# EAGLE design sphericon_v3 (EAGLE 9.6.2)

## Sheet 1 of 2
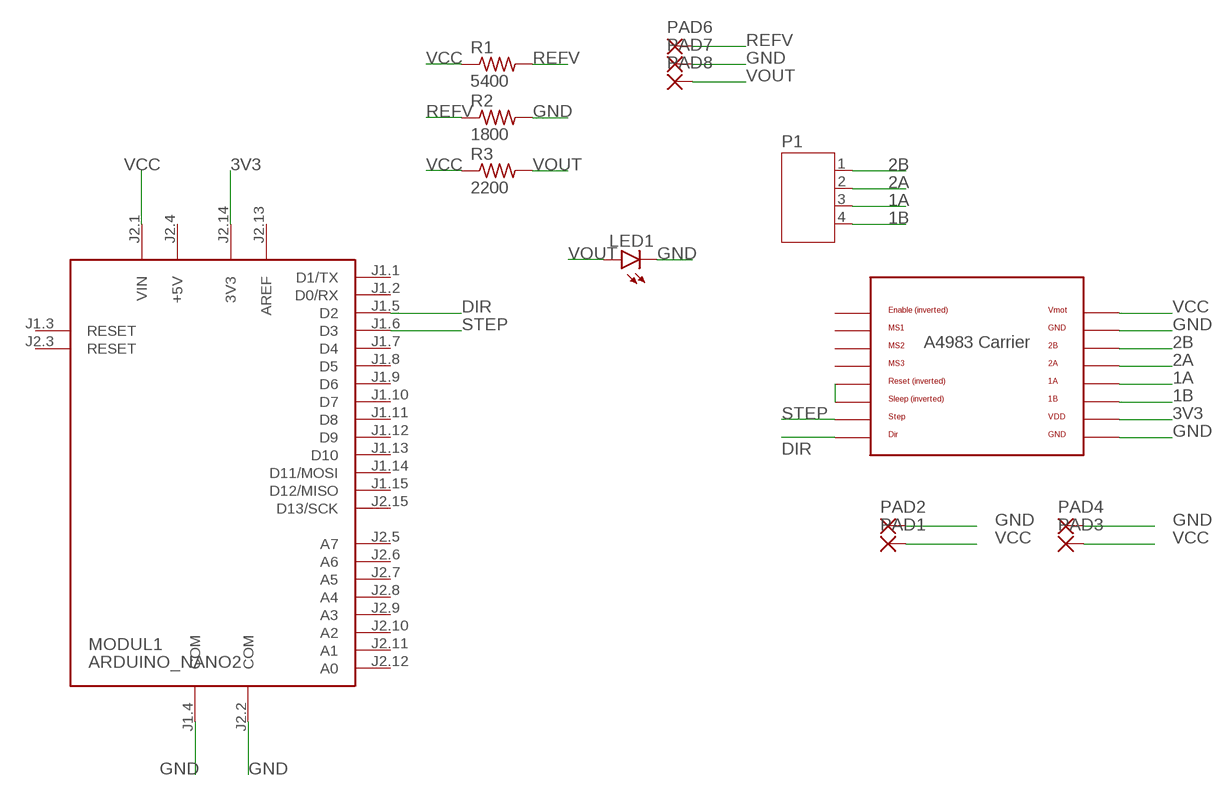
[diagram p0: schematic, sheet 1]

### Parts
LED1  LED3MM  [LED3MM]
MODUL1  ARDUINO_NANO2  [ARDUINO_NANO2]
P1  JST-PH4  [JST-PH4]
PAD1  1,6/0,8  [1,6/0,8]
PAD2  1,6/0,8  [1,6/0,8]
PAD3  1,6/0,8  [1,6/0,8]
PAD4  1,6/0,8  [1,6/0,8]
PAD6  1,6/0,8  [1,6/0,8]
PAD7  1,6/0,8  [1,6/0,8]
PAD8  1,6/0,8  [1,6/0,8]
R1  5400  R-US_0204/2V  [0204V]
R2  1800  R-US_0204/2V  [0204V]
R3  2200  R-US_0204/2V  [0204V]
U$6  POLOLU_A4983CARRIER  [A4983CARRIER]

### Nets
1A: P1.3 U$6.1A
1B: P1.4 U$6.1B
2A: P1.2 U$6.2A
2B: P1.1 U$6.2B
3V3: MODUL1.J2.14(3V3) U$6.VDD
DIR: MODUL1.J1.5(D2) U$6.DIR
GND: LED1.K(C) MODUL1.J1.4(COM) MODUL1.J2.2(COM) PAD2.1(P) PAD4.1(P) PAD7.1(P) R2.2 U$6.GND U$6.GND@0(GND)
N$5 [WiderTraces]: U$6.RST U$6.SLP(SLEEP)
REFV: PAD6.1(P) R1.2 R2.1
STEP: MODUL1.J1.6(D3) U$6.STEP
VCC: MODUL1.J2.1(VIN) PAD1.1(P) PAD3.1(P) R1.1 R3.1 U$6.VMOT
VOUT: LED1.A PAD8.1(P) R3.2
Unconnected: MODUL1.J1.1(D1/TX) MODUL1.J1.2(D0/RX) MODUL1.J1.3(RESET) MODUL1.J1.7(D4) MODUL1.J1.8(D5) MODUL1.J1.9(D6) MODUL1.J1.10(D7) MODUL1.J1.11(D8) MODUL1.J1.12(D9) MODUL1.J1.13(D10) MODUL1.J1.14(D11/MOSI) MODUL1.J1.15(D12/MISO) MODUL1.J2.3(RESET) MODUL1.J2.5(A7) MODUL1.J2.6(A6) MODUL1.J2.7(A5) MODUL1.J2.8(A4) MODUL1.J2.9(A3) MODUL1.J2.10(A2) MODUL1.J2.11(A1) MODUL1.J2.12(A0) MODUL1.J2.15(D13/SCK) U$6.EN U$6.MS1 U$6.MS2 U$6.MS3

## Sheet 2 of 2

## Power pins joined to a net without a drawn wire
+5V: MODUL1.J2.4(+5V)
AREF: MODUL1.J2.13(AREF)

## Library data of the parts
LED1 = led:LED: LED OSRAM: - CHIPLED LG R971, LG N971, LY N971, LG Q971, LY Q971, LO R971, LY R971 LH N974, LH R974 LS Q976, LO Q976, LY Q976 LO Q996 - Hyper CHIPLED LW Q18S LB Q993, LB Q99A, LB R99A - SideLED LS A670, LO A670, LY A670, LG A670, LP A670 LB A673, LV A673, LT A673, LW A673 LH A674 LY A675 LS A676, LA A676, LO A676, LY A676, LW A676 LS A679, LY A679, LG A679 - Hyper Micro SIDELED® LS Y876, LA Y876, LO Y876, LY Y876 LT Y87S - SmartLED LW L88C, LW L88S LB L89C, LB L89S, LG L890 LS L89K, LO L89K, LY L89K LS L896, LA L896, LO L896, LY L896 - TOPLED LS T670, LO T670, LY T670, LG T670, LP T670 LSG T670, LSP T670, LSY T670, LOP T670, LYG T670 LG T671, LOG T671, LSG T671 LB T673, LV T673, LT T673, LW T673 LH T674 LS T676, LA T676, LO T676, LY T676, LB T676, LH T676, LSB T676, LW T676 LB T67C, LV T67C, LT T67C, LS T67K, LO T67K, LY T67K, LW E67C LS E67B, LA E67B, LO E67B, LY E67B, LB E67C, LV E67C, LT E67C LW T67C LS T679, LY T679, LG T679 LS T770, LO T770, LY T770, LG T770, LP T770 LB T773, LV T773, LT T773, LW T773 LH T774 LS E675, LA E675, LY E675, LS T675 LS T776, LA T776, LO T776, LY T776, LB T776 LHGB T686 LT T68C, LB T68C - Hyper Mini TOPLED® LB M676 - Mini TOPLED Santana® LG M470 LS M47K, LO M47K, LY M47K Source: http://www.osram.convergy.de LUXEON: - LUMILED® LXK2-PW12-R00, LXK2-PW12-S00, LXK2-PW14-U00, LXK2-PW14-V00 LXK2-PM12-R00, LXK2-PM12-S00, LXK2-PM14-U00 LXK2-PE12-Q00, LXK2-PE12-R00, LXK2-PE12-S00, LXK2-PE14-T00, LXK2-PE14-U00 LXK2-PB12-K00, LXK2-PB12-L00, LXK2-PB12-M00, LXK2-PB14-N00, LXK2-PB14-P00, LXK2-PB14-Q00 LXK2-PR12-L00, LXK2-PR12-M00, LXK2-PR14-Q00, LXK2-PR14-R00 LXK2-PD12-Q00, LXK2-PD12-R00, LXK2-PD12-S00 LXK2-PH12-R00, LXK2-PH12-S00 LXK2-PL12-P00, LXK2-PL12-Q00, LXK2-PL12-R00 Source: www.luxeon.com KINGBRIGHT: KA-3528ASYC Source: www.kingbright.com
MODUL1 = arduino:ARDUINO_NANO2: Arduino Nano2 Auto generated by modulcreator.ulp \;; ANZAHL: 2; MODUL: TRUE; STECKX0: -76200; STECKX1: 76200; STECKY0: 177800; STECKY1: 177800
P1 = jst-ph:JST-PH4
PAD1-PAD4 PAD6-PAD8 = wirepad:1,6/0,8: THROUGH-HOLE PAD
R1-R3 = resistor:R-US_: RESISTOR, American symbol
U$6 = RepRapjr:POLOLU_A4983CARRIER

## Net classes
1 WiderTraces: width 1.27 mm

## Board
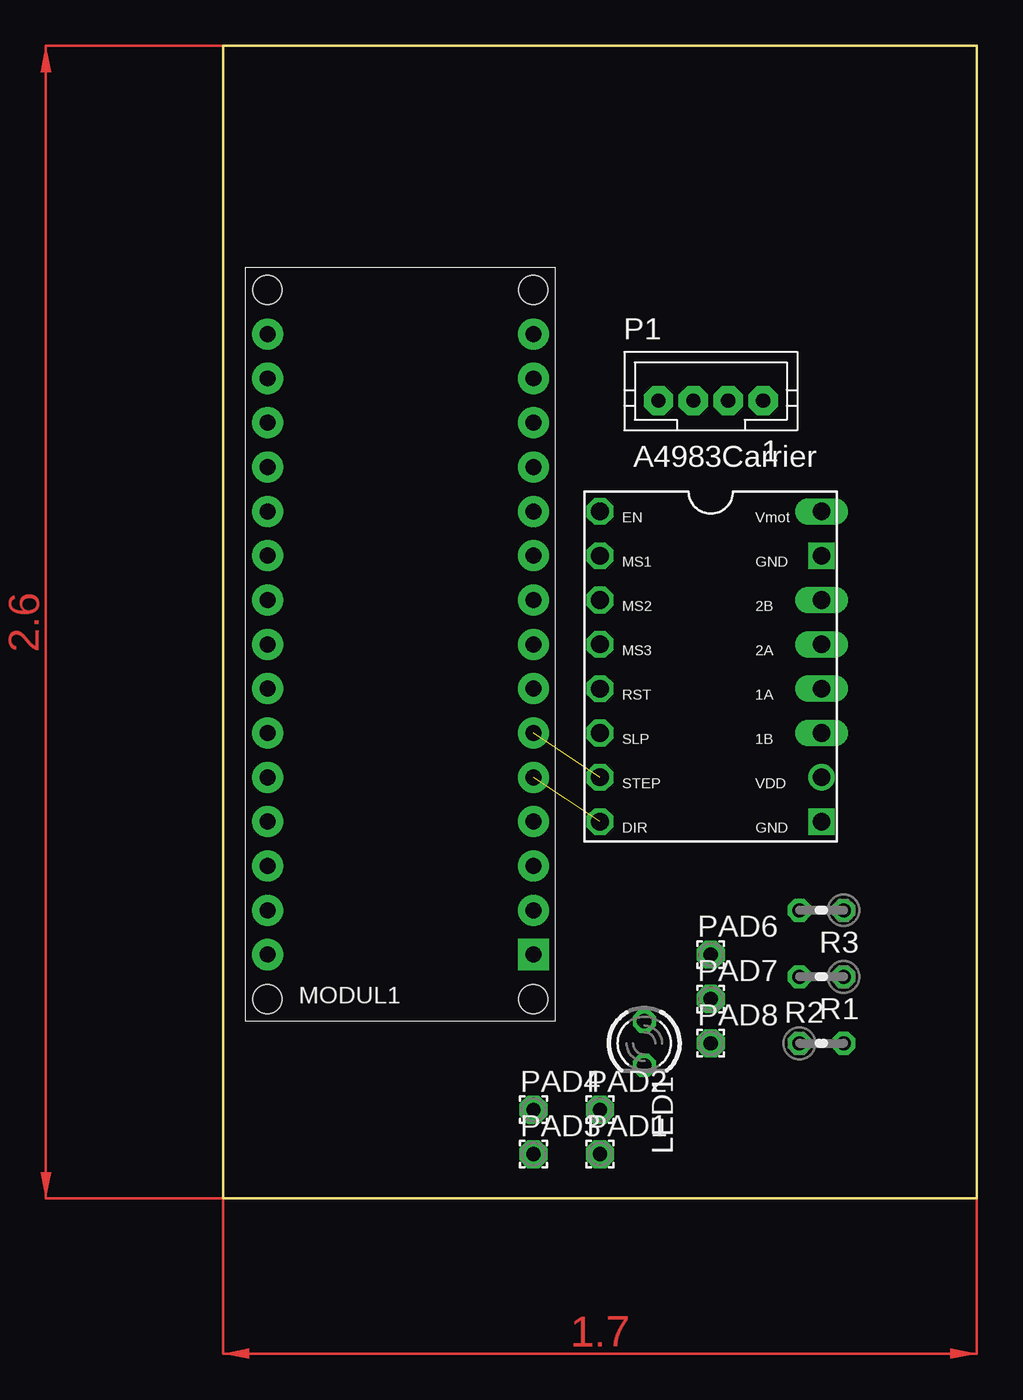
[diagram p1: board, top side]
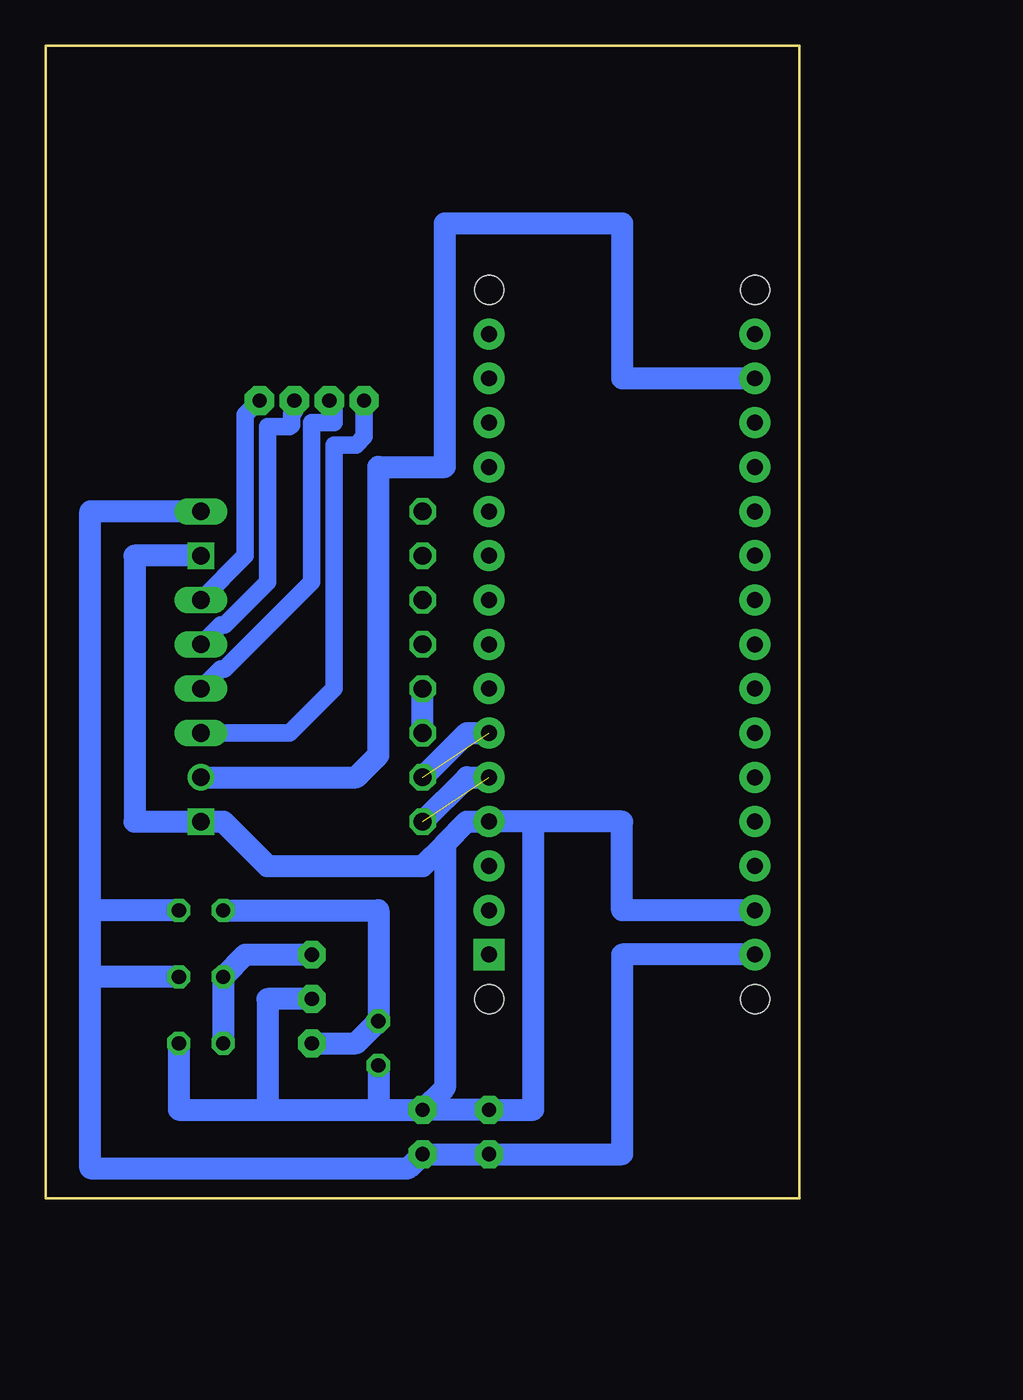
[diagram p2: board, bottom side, seen from below]

Size 43.18 x 66.04 mm. Coordinates in mm from the lower left corner, seen from the top.
Outline: 0,0 0,66.04 43.18,66.04 43.18,0 0,0
Copper layers (1*16): Top 0.035mm / dielectric 1.5mm / Bottom 0.035mm
Design rules "default": minimum track width 6mil, minimum drill 0.35mm, track to track 6mil, track to pad 6mil, pad to pad 6mil, via to via 6mil, smd to smd 6mil, copper to edge 40mil, drill to drill 6mil, minimum pad ring 10mil, minimum via ring 8mil, stop-mask expansion 4mil, vias tented up to drill 0mil, thermal gap 10mil

### Footprints (pad centres in the part's own frame; a part is rotated, then mirrored left to right if it is on the bottom)
LED3MM = drill 0.813 octagon: A -1.27,0; K 1.27,0
ARDUINO_NANO2 = drill 0.914 pad 1.778 square: J1.1 -7.62,17.78 | drill 0.914 pad 1.778: J1.2 -7.62,15.24; J1.3 -7.62,12.7; J1.4 -7.62,10.16; J1.5 -7.62,7.62; J1.6 -7.62,5.08; J1.7 -7.62,2.54; J1.8 -7.62,0; J1.9 -7.62,-2.54; J1.10 -7.62,-5.08; J1.11 -7.62,-7.62; J1.12 -7.62,-10.16; J1.13 -7.62,-12.7; J1.14 -7.62,-15.24; J1.15 -7.62,-17.78; J2.1 7.62,17.78; J2.2 7.62,15.24; J2.3 7.62,12.7; J2.4 7.62,10.16; J2.5 7.62,7.62; J2.6 7.62,5.08; J2.7 7.62,2.54; J2.8 7.62,0; J2.9 7.62,-2.54; J2.10 7.62,-5.08; J2.11 7.62,-7.62; J2.12 7.62,-10.16; J2.13 7.62,-12.7; J2.14 7.62,-15.24; J2.15 7.62,-17.78 | hole 1.651: -7.62,-20.32; 7.62,-20.32; 7.62,20.32; -7.62,20.32
JST-PH4 = drill 0.813 pad 1.676 octagon: 1 3,0; 2 1,0; 3 -1,0; 4 -3,0
1,6/0,8 = drill 0.813 pad 1.6 octagon: 1 0,0
0204V = drill 0.813 octagon: 1 -1.27,0; 2 1.27,0
A4983CARRIER = drill 1.016 long: 1A 8.89,1.27; 1B 11.43,1.27; 2A 6.35,1.27; 2B 3.81,1.27; VMOT -1.27,1.27 | drill 1.016 octagon: DIR 16.51,-11.43; EN -1.27,-11.43; MS1 1.27,-11.43; MS2 3.81,-11.43; MS3 6.35,-11.43; RST 8.89,-11.43; SLP 11.43,-11.43; STEP 13.97,-11.43 | drill 1.016 square: GND 16.51,1.27; GND@0 1.27,1.27 | drill 1.016: VDD 13.97,1.27

### Placement (x,y rotation side)
LED1  24.13,8.89 270 top
MODUL1  10.16,31.75 180 top
P1  27.94,45.72 0 top
PAD1  21.59,2.54 0 top
PAD2  21.59,5.08 0 top
PAD3  17.78,2.54 0 top
PAD4  17.78,5.08 0 top
PAD6  27.94,13.97 0 top
PAD7  27.94,11.43 0 top
PAD8  27.94,8.89 0 top
R1  34.29,12.7 180 top
R2  34.29,8.89 0 top
R3  34.29,16.51 180 top
U$6  33.02,38.1 270 top

### Tracks (layer width: path | path; a pad name or v marks a point on that pad's centre or on a via)
1A
  Bottom 1.016: U$6.1A 33.17,30.33 32.94,30.33 27.94,35.33 27.94,44.45 26.67,44.45 26.67,45.45 P1.3
1B
  Bottom 1.016: U$6.1B 29.21,26.67 26.67,29.21 26.67,43.18 25.4,43.18 24.94,43.64 P1.4
2A
  Bottom 1.016: U$6.2A 33.17,32.87 32.94,32.87 30.48,35.33 30.48,44.22 29.21,44.22 29.11,44.32 29.11,44.93 28.94,45.1 P1.2
2B
  Bottom 1.016: U$6.2B 31.75,36.83 31.75,44.91 P1.1
3V3
  Bottom 1.27: MODUL1.J2.14 10.16,46.99 10.16,55.88 20.32,55.88 20.32,41.91 24.13,41.91 24.13,25.4 25.4,24.13 U$6.VDD
DIR  (1 unrouted)
  Bottom 1.27: U$6.DIR 19.05,24.13 MODUL1.J1.5
GND
  Bottom 1.27: MODUL1.J2.2 10.16,16.51 10.16,21.59 15.24,21.59 | 15.24,21.59 MODUL1.J1.4 19.05,21.59 20.32,20.32 | 20.32,20.32 21.59,19.05 30.48,19.05 33.02,21.59 U$6.GND 38.1,21.59 38.1,36.83 U$6.GND@0 | PAD2.1 PAD4.1 15.24,5.08 15.24,21.59 | PAD2.1 20.32,6.35 20.32,20.32 | R2.2 35.56,5.08 30.48,5.08 | 30.48,5.08 24.13,5.08 | 24.13,5.08 PAD2.1 | PAD7.1 30.48,11.43 30.48,5.08 | LED1.K 24.13,5.08
N$5
  Bottom 1.27: U$6.SLP U$6.RST
REFV
  Bottom 1.27: R2.1 R1.2 31.75,13.97 PAD6.1
STEP  (1 unrouted)
  Bottom 1.27: U$6.STEP 19.05,26.67 MODUL1.J1.6
VCC
  Bottom 1.27: MODUL1.J2.1 10.16,13.97 10.16,2.54 PAD3.1 PAD1.1 22.4,1.73 40.64,1.73 40.64,12.7 | 40.64,12.7 40.64,16.51 | 40.64,16.51 40.64,39.37 U$6.VMOT | R3.1 40.64,16.51 | R1.1 40.64,12.7
VOUT
  Bottom 1.27: PAD8.1 25.4,8.89 LED1.A 24.13,16.51 R3.2
(copper drawn outside any net)
  shapes: Top area x2